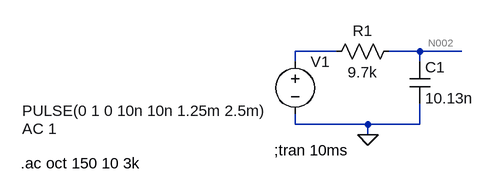
[diagram p0: schematic Draft1.asc]
Draft1.asc, the LTspice schematic file:
Version 4
SHEET 1 880 680
WIRE 208 96 144 96
WIRE 336 96 288 96
WIRE 400 96 336 96
WIRE 144 112 144 96
WIRE 336 112 336 96
WIRE 144 208 144 192
WIRE 256 208 144 208
WIRE 336 208 336 176
WIRE 336 208 256 208
WIRE 256 224 256 208
FLAG 256 224 0
SYMBOL res 304 80 R90
WINDOW 0 0 56 VBottom 2
WINDOW 3 32 56 VTop 2
SYMATTR InstName R1
SYMATTR Value 9.7k
SYMBOL cap 320 112 R0
SYMATTR InstName C1
SYMATTR Value 10.13n
SYMBOL voltage 144 96 R0
WINDOW 123 -420 119 Left 2
WINDOW 39 0 0 Left 0
WINDOW 3 -420 91 Left 2
SYMATTR Value2 AC 1
SYMATTR InstName V1
SYMATTR Value PULSE(0 1 0 10n 10n 1.25m 2.5m)
TEXT 112 248 Left 2 !;tran 10ms
TEXT -278 268 Left 2 !.ac oct 150 10 3k

The netlist it stands for:
* Draft1.asc
R1 N002 N001 9.7k
C1 N002 0 10.13n
V1 N001 0 PULSE(0 1 0 10n 10n 1.25m 2.5m) AC 1
;tran 10ms
.ac oct 150 10 3k
.backanno
.end

* Results of the author's LTspice run, read from the files saved beside the schematic
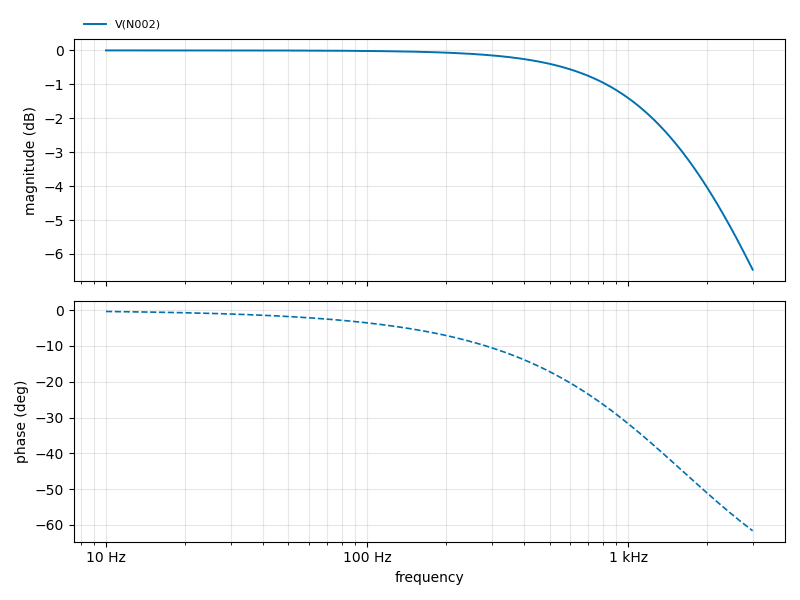
[diagram p1: AC Analysis of Draft1.asc, plotted from the saved traces]
* AC Analysis, 1 run:
*   V(N002): -0.00 dB at 10 Hz, -6.46 dB at 3 kHz, peak -0.00 dB at 10 Hz, 3 dB below the peak at 1.62 kHz